# EAGLE design match3 (EAGLE 7.2.0)
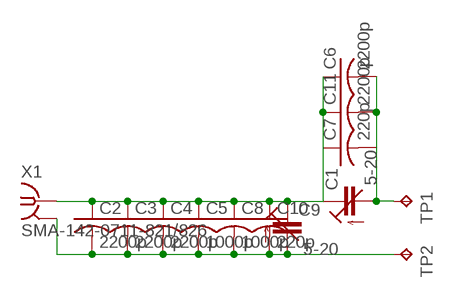
[diagram p0: schematic, sheet 1]

## Parts
C1  5-20  C-TRIMM  [SGC3S]
C2  2200p  C-USC0805  [C0805]
C3  2200p  C-USC0805  [C0805]
C4  2200p  C-USC0805  [C0805]
C5  1000p  C-USC0805  [C0805]
C6  2200p  C-USC0805  [C0805]
C7  220p  C-USC0805  [C0805]
C8  1000p  C-USC0805  [C0805]
C9  5-20  C-TRIMM  [SGC3S]
C10  220p  C-USC0805  [C0805]
C11  2200p  C-USC0805  [C0805]
TP1  TPPAD1-13Y  [P1-13Y]
TP2  TPPAD1-13Y  [P1-13Y]
X1  SMA-142-0711-821/826  [J502-ND-142-0711-821/826]

## Nets
N$1: C1.P$1(A) C6.2 C7.2 C11.2 TP1.TP
N$2: C2.2 C3.2 C4.2 C5.2 C8.2 C9.P$1(A) C10.2 TP2.TP X1.G@1 X1.G@2 X1.G@3 X1.G@4
N$7: C1.P$2(E) C2.1 C3.1 C4.1 C5.1 C6.1 C7.1 C8.1 C9.P$2(E) C10.1 C11.1 X1.1

## Library data of the parts
C1 C9 = sprague:C-TRIMM: Trimm capacitor
C2-C8 C10 C11 = rcl:C-US: CAPACITOR, American symbol
TP1 TP2 = testpad:TP: Test pad
X1 = con-coax:SMA-: SMA 50 Ohm End Launch Jack Receptacle - Round Contact Johnson Components Source: www.johnsoncomponents.com .. J502-ND.pdf; MF: JOHNSON COMPONENTS; MPN: 142-0711-821; OC_FARNELL: 1019328; OC_NEWARK: 16F3627

## Board
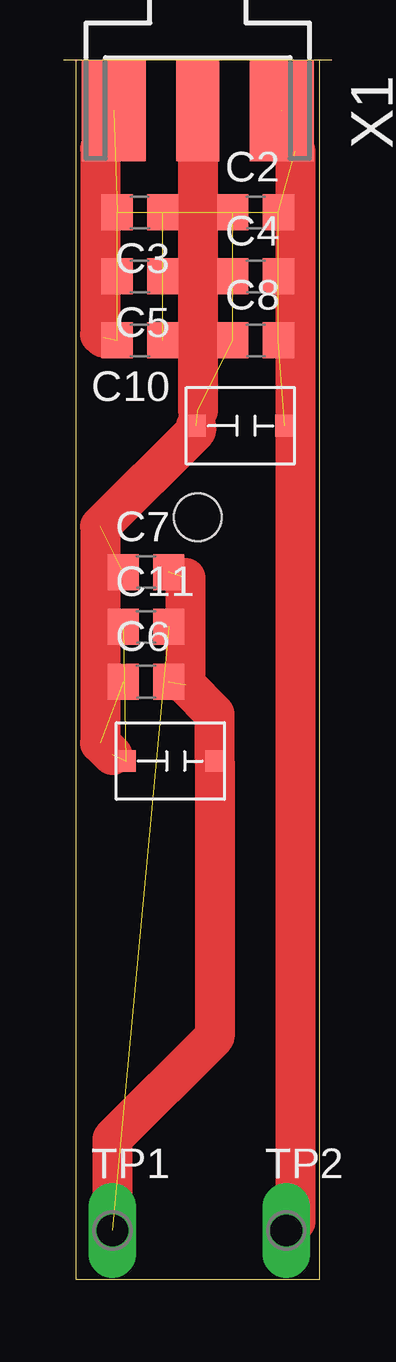
[diagram p1: board, top side]
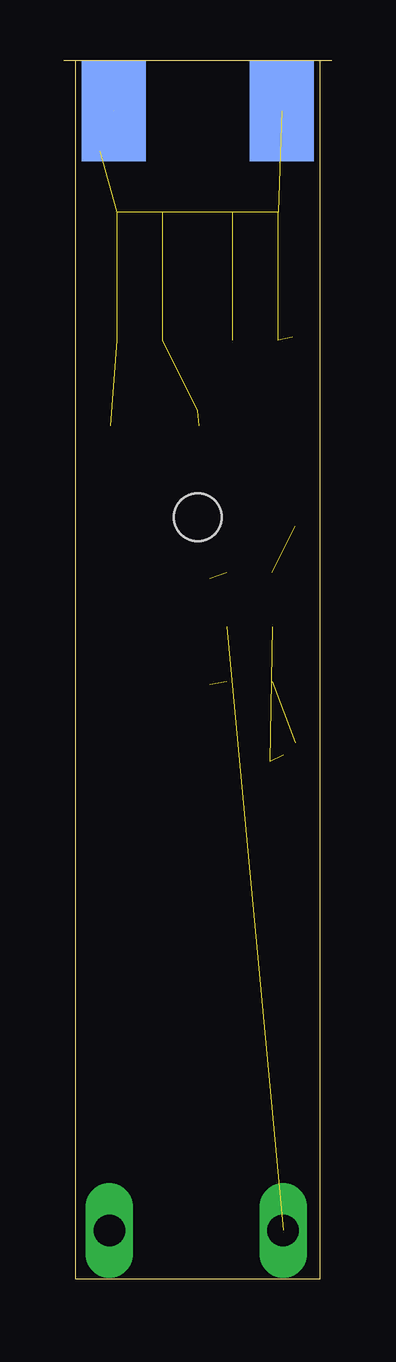
[diagram p2: board, bottom side, seen from below]

Size 10.16 x 50.8 mm. Coordinates in mm from the lower left corner, seen from the top.
Outline: 0,0 10.16,0 10.16,50.8 0,50.8 0,0
Copper layers (1*16): Top 0.035mm / dielectric 1.5mm / Bottom 0.035mm
Design rules "default": minimum track width 10mil, minimum drill 24mil, track to track 8mil, track to pad 8mil, pad to pad 8mil, via to via 8mil, smd to smd 8mil, copper to edge 40mil, drill to drill 8mil, minimum pad ring 10mil, minimum via ring 8mil, stop-mask expansion 4mil, vias tented up to drill 0mil, thermal gap 10mil
Holes 2 mm at 5.08,31.75

### Footprints (pad centres in the part's own frame; a part is rotated, then mirrored left to right if it is on the bottom)
SGC3S = smd 0.9 x 0.8: P$1 0,1.85; P$2 0,-1.85
C0805 = smd 1.3 x 1.5: 1 -0.95,0; 2 0.95,0
P1-13Y = drill 1.321 pad 1.905 long: TP 0,0
J502-ND-142-0711-821/826 = smd 4.191 x 1.778: 1 2.115,0 | smd 4.191 x 2.667: G@1 2.115,3.495; G@2 2.115,-3.495 | smd 4.191 x 2.667 bottom: G@3 2.115,3.495; G@4 2.115,-3.495

### Placement (x,y rotation side)
C1  3.94,21.59 270 top
C2  7.49,44.45 0 top
C3  2.67,44.45 180 top
C4  7.49,41.78 0 top
C5  2.67,41.78 180 top
C6  2.92,24.89 0 top
C7  2.92,29.46 0 top
C8  7.49,39.12 0 top
C9  6.86,35.56 270 top
C10  2.67,39.12 180 top
C11  2.92,27.18 0 top
TP1  1.52,2.03 0 top
TP2  8.76,2.03 0 top
X1  5.08,50.8 270 top

### Tracks (layer width: path | path; a pad name or v marks a point on that pad's centre or on a via)
N$1  (3 unrouted)
  Top 1.676: 4.57,29.21 4.57,24.77 5.79,23.55 C1.P$1 5.79,10.1 1.52,5.84 TP1.TP
N$2  (10 unrouted)
  Top 1.676: X1.G@3 8.57,47.56 9.14,46.99 9.14,2.41 TP2.TP | X1.G@4 1.58,47.69 1.02,47.12 1.02,39.37 1.14,39.24
N$7  (11 unrouted)
  Top 1.676: X1.1 5.08,36.2 | C9.P$2 5.01,35.36 1.02,31.37 1.02,22.35 1.52,21.84